# EAGLE design tssop24 (EAGLE 6.4)
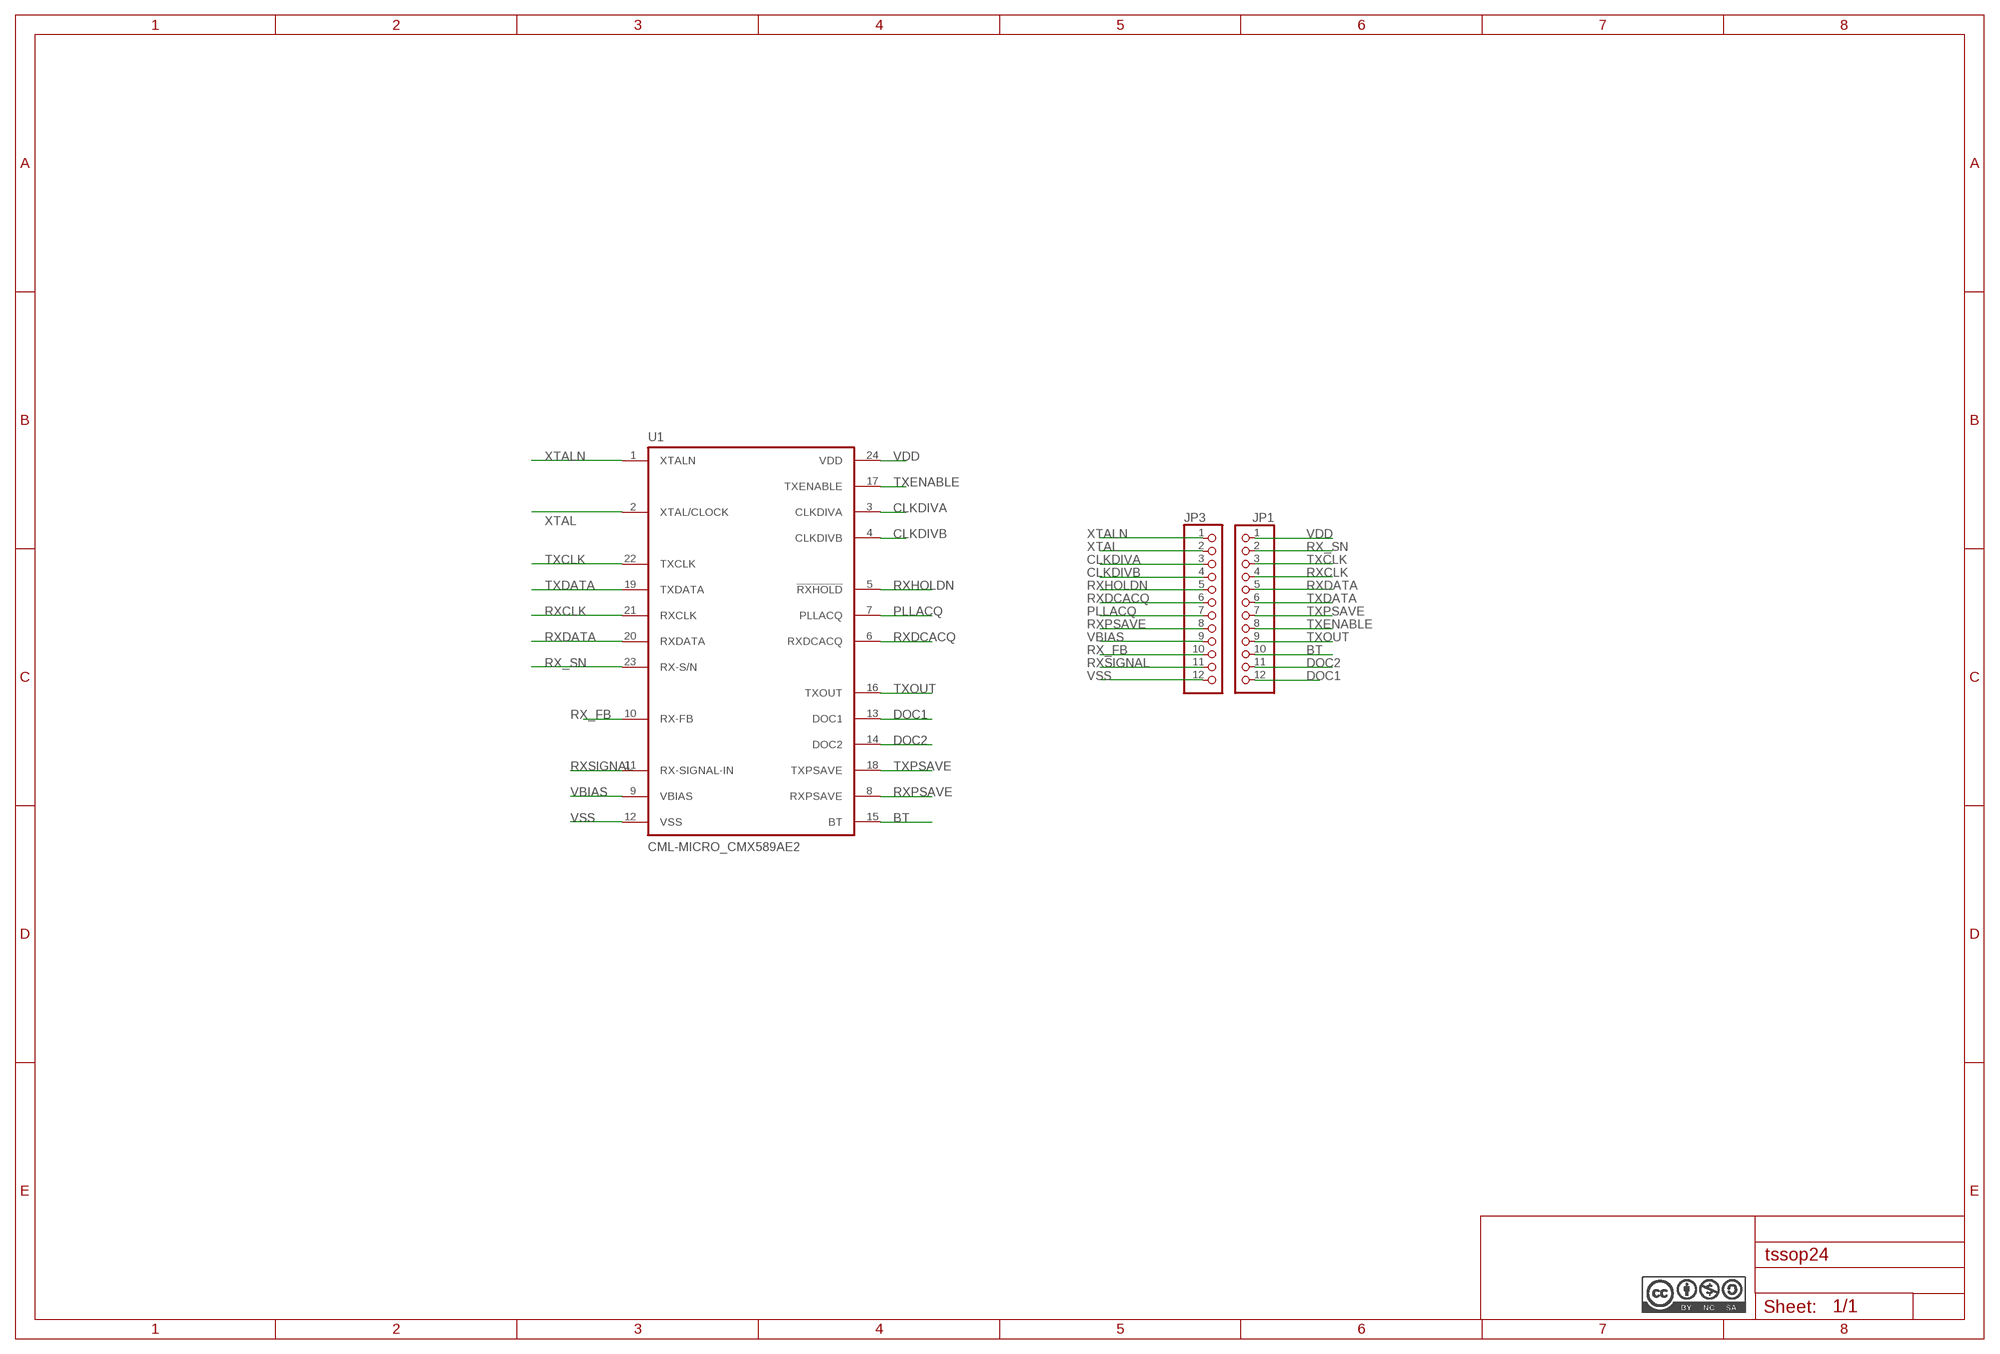
[diagram p0: schematic, sheet 1]

## Parts
JP1  PINHD-1X12-CB  [1X12-CB]
JP3  PINHD-1X12-CB  [1X12-CB]
U1  CML-MICRO_CMX589AE2  AIS_MK2_CML-MICRO_CMX589AE2  [AIS_MK2_CML-MICRO_TSSOP24]

## Nets
BT: JP1.10 U1.15(BT)
CLKDIVA: JP3.3 U1.3(CLKDIVA)
CLKDIVB: JP3.4 U1.4(CLKDIVB)
DOC1: JP1.12 U1.13(DOC1)
DOC2: JP1.11 U1.14(DOC2)
PLLACQ: JP3.7 U1.7(PLLACQ)
RX_FB: JP3.10 U1.10(RX-FB)
RX_SN: JP1.2 U1.23(RX-S/N)
RXCLK: JP1.4 U1.21(RXCLK)
RXDATA: JP1.5 U1.20(RXDATA)
RXDCACQ: JP3.6 U1.6(RXDCACQ)
RXHOLDN: JP3.5 U1.5(!RXHOLD!)
RXPSAVE: JP3.8 U1.8(RXPSAVE)
RXSIGNAL: JP3.11 U1.11(RX-SIGNAL-IN)
TXCLK: JP1.3 U1.22(TXCLK)
TXDATA: JP1.6 U1.19(TXDATA)
TXENABLE: JP1.8 U1.17(TXENABLE)
TXOUT: JP1.9 U1.16(TXOUT)
TXPSAVE: JP1.7 U1.18(TXPSAVE)
VBIAS: JP3.9 U1.9(VBIAS)
VDD: JP1.1 U1.24(VDD)
VSS: JP3.12 U1.12(VSS)
XTAL: JP3.2 U1.2(XTAL/CLOCK)
XTALN: JP3.1 U1.1(XTALN)

## Library data of the parts
JP1 JP3 = adafruit:PINHD-1X12: PIN HEADER
U1 = 12_dollar:AIS_MK2_CML-MICRO_CMX589A: HIGH-SPEED GMSK MODEM

## Net classes
1 pwr: width 0.381 mm

## Board
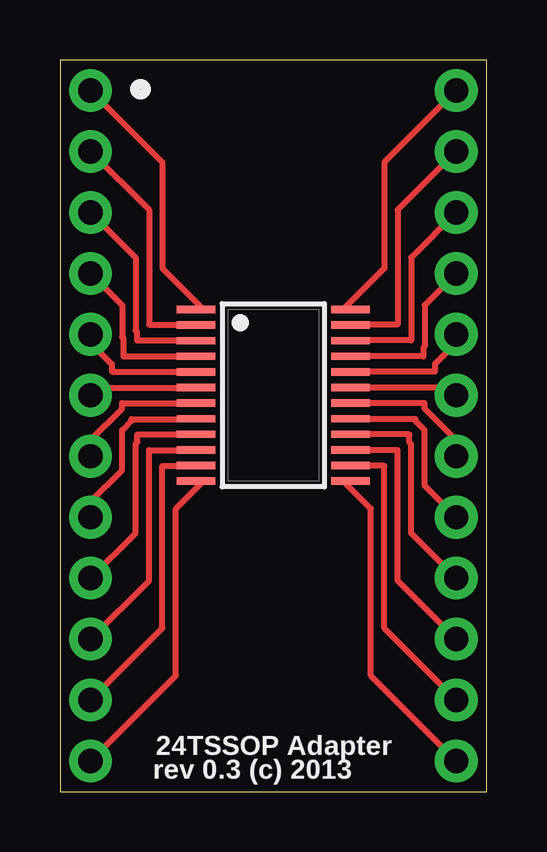
[diagram p1: board, top side]
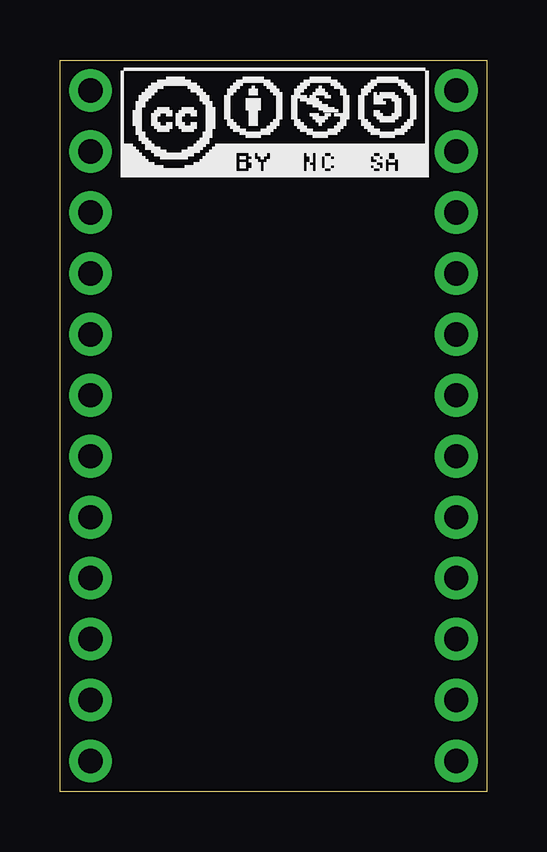
[diagram p2: board, bottom side, seen from below]

Size 17.78 x 30.48 mm. Coordinates in mm from the lower left corner, seen from the top.
Outline: 0,0 17.78,0 17.78,30.48 0,30.48 0,0
Copper layers (1*16): Top 0.0356mm / dielectric 1.5011mm / Bottom 0.0356mm
Design rules "LaenPCBOrder": minimum track width 6mil, minimum drill 13mil, track to track 6mil, track to pad 6mil, pad to pad 6mil, via to via 6mil, smd to smd 6mil, copper to edge 15mil, drill to drill 6mil, minimum pad ring 7mil, minimum via ring 7mil, stop-mask expansion 4mil, vias tented up to drill 0mil, thermal gap 10mil

### Footprints (pad centres in the part's own frame; a part is rotated, then mirrored left to right if it is on the bottom)
1X12-CB = drill 1.016 pad 1.778: 1 -13.97,0; 2 -11.43,0; 3 -8.89,0; 4 -6.35,0; 5 -3.81,0; 6 -1.27,0; 7 1.27,0; 8 3.81,0; 9 6.35,0; 10 8.89,0; 11 11.43,0; 12 13.97,0
AIS_MK2_CML-MICRO_TSSOP24 = smd 0.305 x 1.6: 1 -3.575,-3.217; 2 -2.925,-3.217; 3 -2.275,-3.217; 4 -1.625,-3.217; 5 -0.975,-3.217; 6 -0.325,-3.217; 7 0.325,-3.217; 8 0.975,-3.217; 9 1.625,-3.217; 10 2.275,-3.217; 11 2.925,-3.217; 12 3.575,-3.217; 13 3.575,3.217; 14 2.925,3.217; 15 2.275,3.217; 16 1.625,3.217; 17 0.975,3.217; 18 0.325,3.217; 19 -0.325,3.217; 20 -0.975,3.217; 21 -1.625,3.217; 22 -2.275,3.218; 23 -2.925,3.217; 24 -3.575,3.217

### Placement (x,y rotation side)
JP1  16.51,15.24 270 top
JP3  1.27,15.24 270 top
U1  8.89,16.51 270 top

### Tracks (layer width: path | path; a pad name or v marks a point on that pad's centre or on a via)
BT
  Top 0.254: JP1.10 14.07,8.79 14.07,14.22 11.81,14.22 U1.15
CLKDIVA
  Top 0.254: JP3.3 3.15,22.25 3.15,19.2 3.2,19.15 3.2,18.8 5.97,18.8 U1.3
CLKDIVB
  Top 0.254: JP3.4 2.59,20.27 2.59,18.95 2.64,18.9 2.64,18.14 5.97,18.14 U1.4
DOC1
  Top 0.254: JP1.12 12.95,4.83 12.95,11.79 11.81,12.93 U1.13
DOC2
  Top 0.254: JP1.11 13.51,6.81 13.51,13.56 11.81,13.56 U1.14
PLLACQ
  Top 0.254: JP3.7 1.27,14.63 2.59,15.95 2.59,16.18 5.97,16.18 U1.7
RX_FB
  Top 0.254: JP3.10 3.71,8.79 3.71,14.22 5.97,14.22 U1.10
RX_SN
  Top 0.254: JP1.2 14.07,24.23 14.07,19.46 11.81,19.46 U1.23
RXCLK
  Top 0.254: JP1.4 15.19,20.27 15.19,18.54 15.14,18.49 15.14,18.14 11.81,18.14 U1.21
RXDATA
  Top 0.254: JP1.5 16.51,18.69 15.62,17.8 15.62,17.5 11.81,17.5 U1.20
RXDCACQ
  Top 0.254: JP3.6 1.27,16.82 5.97,16.82 U1.6
RXHOLDN
  Top 0.254: JP3.5 1.27,18.69 2.16,17.8 2.16,17.5 5.97,17.5 U1.5
RXPSAVE
  Top 0.254: JP3.8 1.27,12.06 2.59,13.39 2.59,15.06 2.97,15.44 2.97,15.52 5.97,15.52 U1.8
RXSIGNAL
  Top 0.254: JP3.11 4.27,6.81 4.27,13.56 5.97,13.56 U1.11
TXCLK
  Top 0.254: JP1.3 14.63,22.25 14.63,18.8 11.81,18.8 U1.22
TXDATA
  Top 0.254: JP1.6 16.51,16.82 11.81,16.82 U1.19
TXENABLE
  Top 0.254: JP1.8 15.19,12.75 15.19,15.06 14.81,15.44 14.81,15.52 11.81,15.52 U1.17
TXOUT
  Top 0.254: JP1.9 14.63,10.77 14.63,14.48 14.55,14.55 14.55,14.88 11.81,14.88 U1.16
TXPSAVE
  Top 0.254: JP1.7 16.51,14.63 15.19,15.95 15.19,16.18 11.81,16.18 U1.18
VBIAS
  Top 0.254: JP3.9 3.15,10.77 3.15,14.48 3.23,14.55 3.23,14.88 5.97,14.88 U1.9
VDD
  Top 0.254: JP1.1 13.51,26.21 13.51,21.79 11.81,20.09 U1.24
VSS
  Top 0.254: JP3.12 4.83,4.83 4.83,11.79 5.97,12.93 U1.12
XTAL
  Top 0.254: JP3.2 3.71,24.23 3.71,19.46 5.97,19.46 U1.2
XTALN
  Top 0.254: JP3.1 4.27,26.21 4.27,21.79 5.97,20.09 U1.1

### Text on the board
tNames: 24TSSOP Adapter | rev 0.3 (c) 2013